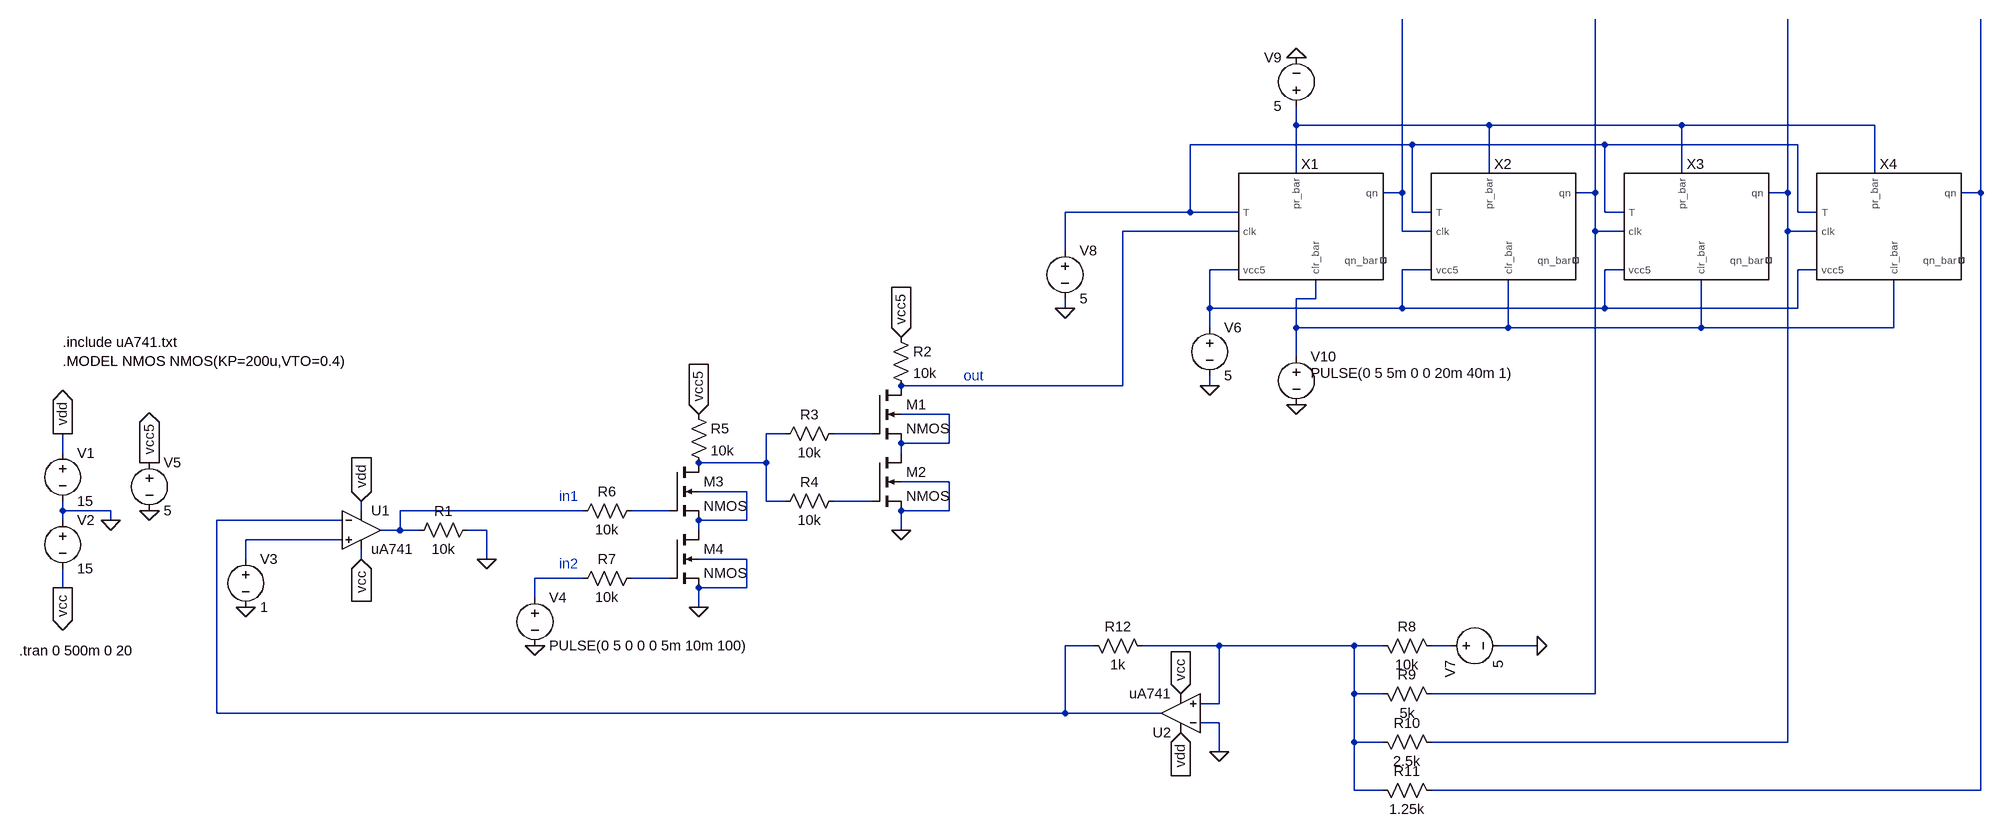
[diagram p0: schematic adc.asc]
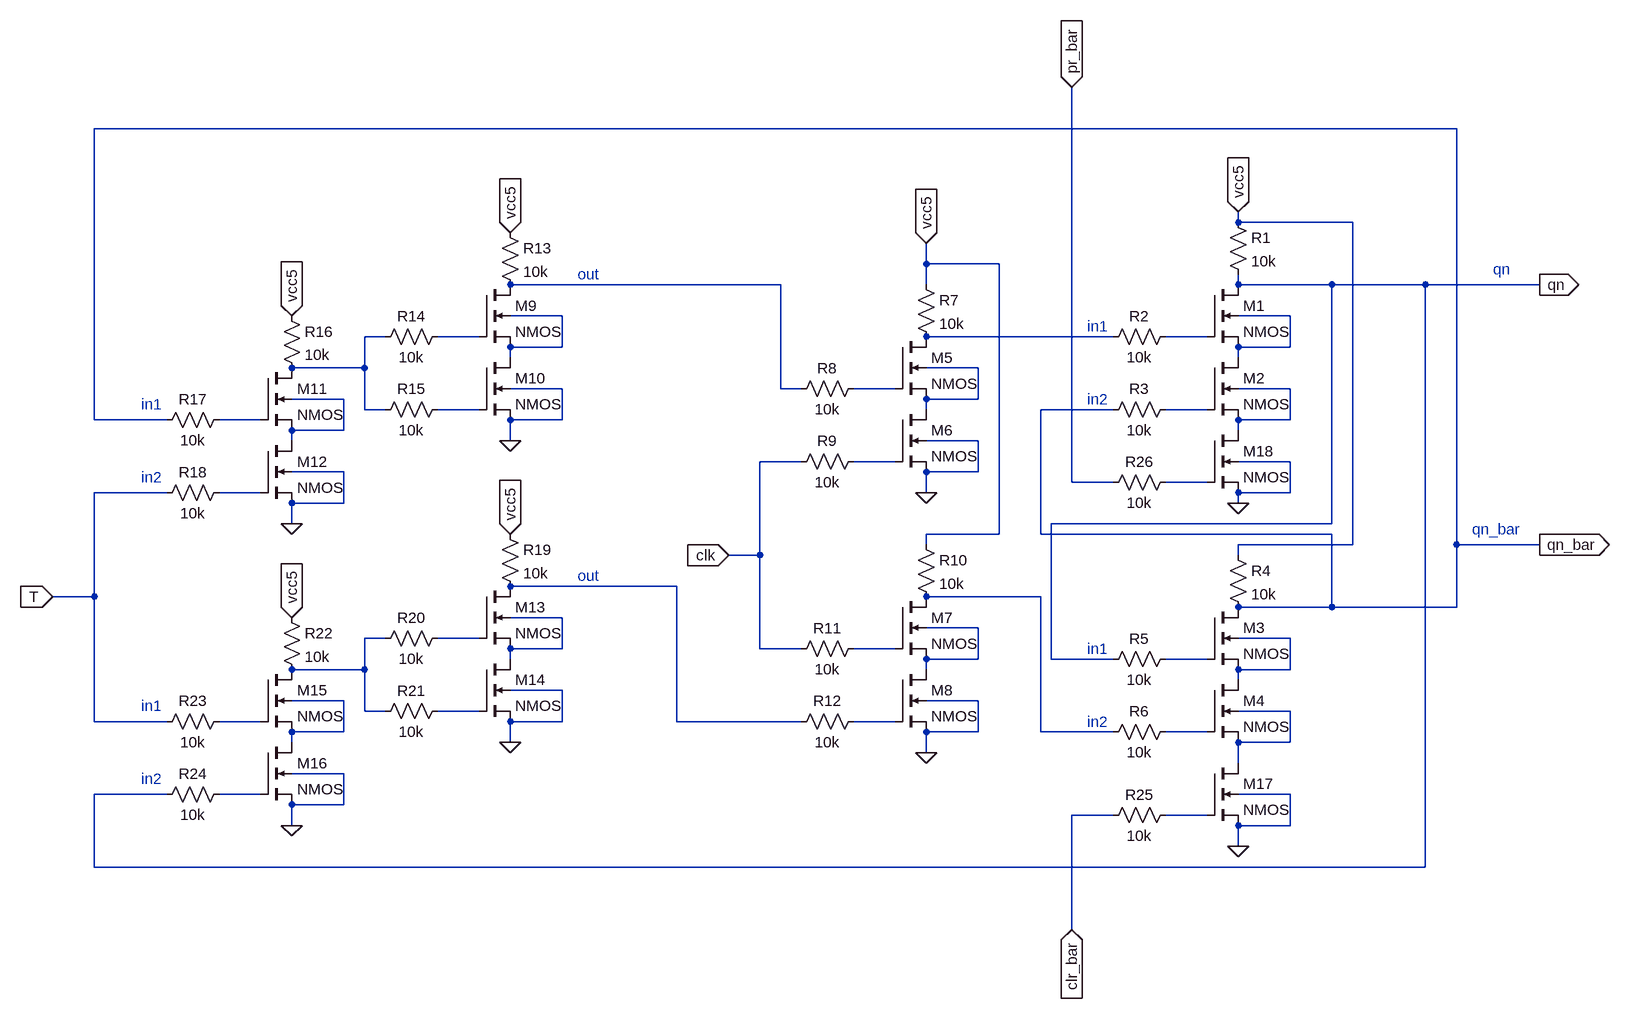
[diagram p1: sub-circuit t_ff_scimatic.asc]
adc.asc, the LTspice schematic file:
Version 4
SHEET 1 2512 680
WIRE 1360 -592 1360 -624
WIRE 1680 -592 1360 -592
WIRE 2000 -592 1680 -592
WIRE 2320 -592 2000 -592
WIRE 1552 -560 1184 -560
WIRE 1872 -560 1552 -560
WIRE 2192 -560 1872 -560
WIRE 1360 -512 1360 -592
WIRE 1680 -512 1680 -592
WIRE 2000 -512 2000 -592
WIRE 2320 -512 2320 -592
WIRE 1536 -480 1536 -768
WIRE 1536 -480 1504 -480
WIRE 1856 -480 1856 -768
WIRE 1856 -480 1824 -480
WIRE 2176 -480 2176 -768
WIRE 2176 -480 2144 -480
WIRE 2496 -480 2496 -768
WIRE 2496 -480 2464 -480
WIRE 1184 -448 1184 -560
WIRE 1184 -448 976 -448
WIRE 1264 -448 1184 -448
WIRE 1552 -448 1552 -560
WIRE 1584 -448 1552 -448
WIRE 1872 -448 1872 -560
WIRE 1904 -448 1872 -448
WIRE 2192 -448 2192 -560
WIRE 2224 -448 2192 -448
WIRE 1264 -416 1072 -416
WIRE 1536 -416 1536 -480
WIRE 1584 -416 1536 -416
WIRE 1856 -416 1856 -480
WIRE 1904 -416 1856 -416
WIRE 2176 -416 2176 -480
WIRE 2224 -416 2176 -416
WIRE 976 -384 976 -448
WIRE 1264 -352 1216 -352
WIRE 1584 -352 1536 -352
WIRE 1904 -352 1872 -352
WIRE 2224 -352 2192 -352
WIRE 1392 -304 1392 -336
WIRE 1392 -304 1360 -304
WIRE 976 -288 976 -304
WIRE 1216 -288 1216 -352
WIRE 1536 -288 1536 -352
WIRE 1536 -288 1216 -288
WIRE 1872 -288 1872 -352
WIRE 1872 -288 1536 -288
WIRE 2192 -288 2192 -352
WIRE 2192 -288 1872 -288
WIRE 1216 -256 1216 -288
WIRE 1360 -256 1360 -304
WIRE 1712 -256 1712 -336
WIRE 1712 -256 1360 -256
WIRE 2032 -256 2032 -336
WIRE 2032 -256 1712 -256
WIRE 2352 -256 2352 -336
WIRE 2352 -256 2032 -256
WIRE 1360 -208 1360 -256
WIRE 1072 -160 1072 -416
WIRE 1072 -160 704 -160
WIRE 1216 -160 1216 -176
WIRE 784 -112 704 -112
WIRE 512 -80 480 -80
WIRE 656 -80 592 -80
WIRE 784 -64 784 -112
WIRE 784 -64 704 -64
WIRE -688 -48 -688 -80
WIRE 704 -48 704 -64
WIRE 480 -32 480 -80
WIRE 480 -32 368 -32
WIRE 784 0 704 0
WIRE 448 16 368 16
WIRE 480 32 480 -32
WIRE 512 32 480 32
WIRE 656 32 592 32
WIRE -688 48 -688 32
WIRE -608 48 -688 48
WIRE -192 48 -192 32
WIRE 176 48 -128 48
WIRE 320 48 256 48
WIRE 784 48 784 0
WIRE 784 48 704 48
WIRE -688 64 -688 48
WIRE -608 64 -608 48
WIRE -224 64 -432 64
WIRE 448 64 448 16
WIRE 448 64 368 64
WIRE -128 80 -128 48
WIRE -128 80 -160 80
WIRE -96 80 -128 80
WIRE 16 80 -16 80
WIRE 368 80 368 64
WIRE 704 80 704 48
WIRE -224 96 -384 96
WIRE -384 128 -384 96
WIRE -192 128 -192 112
WIRE 16 128 16 80
WIRE 448 128 368 128
WIRE 176 160 96 160
WIRE 320 160 256 160
WIRE -688 176 -688 144
WIRE 448 176 448 128
WIRE 448 176 368 176
WIRE 96 192 96 160
WIRE 368 208 368 176
WIRE 1024 272 976 272
WIRE 1232 272 1104 272
WIRE 1456 272 1232 272
WIRE 1504 272 1456 272
WIRE 1616 272 1584 272
WIRE 1760 272 1696 272
WIRE 1456 352 1456 272
WIRE 1504 352 1456 352
WIRE 1856 352 1856 -416
WIRE 1856 352 1584 352
WIRE 1232 368 1232 272
WIRE 1232 368 1200 368
WIRE -432 384 -432 64
WIRE 976 384 976 272
WIRE 976 384 -432 384
WIRE 1136 384 976 384
WIRE 1232 400 1200 400
WIRE 1456 432 1456 352
WIRE 1504 432 1456 432
WIRE 2176 432 2176 -416
WIRE 2176 432 1584 432
WIRE 1232 448 1232 400
WIRE 1456 512 1456 432
WIRE 1504 512 1456 512
WIRE 2496 512 2496 -480
WIRE 2496 512 1584 512
FLAG -192 128 vcc
IOPIN -192 128 In
FLAG -192 32 vdd
IOPIN -192 32 In
FLAG -608 64 0
FLAG -688 -80 vdd
IOPIN -688 -80 Out
FLAG -688 176 vcc
IOPIN -688 176 Out
FLAG 16 128 0
FLAG -384 208 0
FLAG 704 80 0
FLAG 368 208 0
FLAG 96 272 0
FLAG 704 -240 vcc5
IOPIN 704 -240 In
FLAG 368 -112 vcc5
IOPIN 368 -112 In
FLAG -544 48 0
FLAG -544 -32 vcc5
IOPIN -544 -32 Out
FLAG 1216 -160 0
FLAG 976 -288 0
FLAG 1360 -128 0
FLAG 1360 -704 0
FLAG 1760 272 0
FLAG 1232 448 0
FLAG 1168 416 vdd
IOPIN 1168 416 In
FLAG 1168 352 vcc
IOPIN 1168 352 In
DATAFLAG 1536 -672 ""
DATAFLAG 1856 -672 ""
DATAFLAG 2176 -672 ""
DATAFLAG 2496 -688 ""
DATAFLAG 1024 -160 ""
DATAFLAG 656 384 ""
DATAFLAG 1360 272 ""
SYMBOL OpAmps\\opamp2 -192 16 R0
SYMATTR InstName U1
SYMATTR Value uA741
SYMBOL voltage -688 -64 R0
WINDOW 123 0 0 Left 0
WINDOW 39 0 0 Left 0
SYMATTR InstName V1
SYMATTR Value 15
SYMBOL voltage -688 48 R0
WINDOW 123 0 0 Left 0
WINDOW 39 0 0 Left 0
SYMATTR InstName V2
SYMATTR Value 15
SYMBOL res 0 64 R90
WINDOW 0 0 56 VBottom 2
WINDOW 3 32 56 VTop 2
SYMATTR InstName R1
SYMATTR Value 10k
SYMBOL voltage -384 112 R0
WINDOW 123 0 0 Left 0
WINDOW 39 0 0 Left 0
SYMATTR InstName V3
SYMATTR Value 1
SYMBOL nmos4 656 -160 R0
SYMATTR InstName M1
SYMATTR Value2 l=0.5u w=400u
SYMBOL nmos4 656 -48 R0
SYMATTR InstName M2
SYMATTR Value2 l=0.5u w=400u
SYMBOL res 688 -256 R0
SYMATTR InstName R2
SYMATTR Value 10k
SYMBOL res 608 -96 R90
WINDOW 0 0 56 VBottom 2
WINDOW 3 32 56 VTop 2
SYMATTR InstName R3
SYMATTR Value 10k
SYMBOL res 608 16 R90
WINDOW 0 0 56 VBottom 2
WINDOW 3 32 56 VTop 2
SYMATTR InstName R4
SYMATTR Value 10k
SYMBOL nmos4 320 -32 R0
SYMATTR InstName M3
SYMATTR Value2 l=0.5u w=400u
SYMBOL nmos4 320 80 R0
SYMATTR InstName M4
SYMATTR Value2 l=0.5u w=400u
SYMBOL res 352 -128 R0
SYMATTR InstName R5
SYMATTR Value 10k
SYMBOL res 272 32 R90
WINDOW 0 0 56 VBottom 2
WINDOW 3 32 56 VTop 2
SYMATTR InstName R6
SYMATTR Value 10k
SYMBOL res 272 144 R90
WINDOW 0 0 56 VBottom 2
WINDOW 3 32 56 VTop 2
SYMATTR InstName R7
SYMATTR Value 10k
SYMBOL voltage 96 176 R0
WINDOW 123 0 0 Left 0
WINDOW 39 0 0 Left 0
SYMATTR InstName V4
SYMATTR Value PULSE(0 5 0 0 0 5m 10m 100)
SYMBOL voltage -544 -48 R0
WINDOW 123 0 0 Left 0
WINDOW 39 0 0 Left 0
SYMATTR InstName V5
SYMATTR Value 5
SYMBOL T_FF_scimatic 1376 -416 R0
SYMATTR InstName X1
SYMBOL T_FF_scimatic 1696 -416 R0
SYMATTR InstName X2
SYMBOL T_FF_scimatic 2016 -416 R0
SYMATTR InstName X3
SYMBOL T_FF_scimatic 2336 -416 R0
SYMATTR InstName X4
SYMBOL voltage 1216 -272 R0
WINDOW 123 0 0 Left 0
WINDOW 39 0 0 Left 0
SYMATTR InstName V6
SYMATTR Value 5
SYMBOL voltage 976 -400 R0
WINDOW 123 0 0 Left 0
WINDOW 39 0 0 Left 0
SYMATTR InstName V8
SYMATTR Value 5
SYMBOL voltage 1360 -608 R180
WINDOW 0 24 96 Left 2
WINDOW 3 24 16 Left 2
WINDOW 123 0 0 Left 0
WINDOW 39 0 0 Left 0
SYMATTR InstName V9
SYMATTR Value 5
SYMBOL voltage 1360 -224 R0
WINDOW 3 24 44 Left 2
WINDOW 123 0 0 Left 0
WINDOW 39 0 0 Left 0
SYMATTR Value PULSE(0 5 5m 0 0 20m 40m 1)
SYMATTR InstName V10
SYMBOL res 1488 256 M90
WINDOW 0 0 56 VBottom 2
WINDOW 3 32 56 VTop 2
SYMATTR InstName R8
SYMATTR Value 10k
SYMBOL res 1488 336 M90
WINDOW 0 0 56 VBottom 2
WINDOW 3 32 56 VTop 2
SYMATTR InstName R9
SYMATTR Value 5k
SYMBOL res 1488 416 M90
WINDOW 0 0 56 VBottom 2
WINDOW 3 32 56 VTop 2
SYMATTR InstName R10
SYMATTR Value 2.5k
SYMBOL res 1488 496 M90
WINDOW 0 0 56 VBottom 2
WINDOW 3 32 56 VTop 2
SYMATTR InstName R11
SYMATTR Value 1.25k
SYMBOL OpAmps\\opamp2 1168 448 R180
SYMATTR InstName U2
SYMATTR Value uA741
SYMBOL res 1008 256 M90
WINDOW 0 0 56 VBottom 2
WINDOW 3 32 56 VTop 2
SYMATTR InstName R12
SYMATTR Value 1k
SYMBOL voltage 1600 272 M90
WINDOW 123 0 0 Left 0
WINDOW 39 0 0 Left 0
SYMATTR InstName V7
SYMATTR Value 5
TEXT -760 280 Left 2 !.tran 0 500m 0 20
TEXT -688 -232 Left 2 !.include uA741.txt
TEXT 808 -176 Left 2 ;out
TEXT 136 24 Left 2 ;in1
TEXT 136 136 Left 2 ;in2
TEXT -688 -200 Left 2 !.MODEL NMOS NMOS(KP=200u,VTO=0.4)

t_ff_scimatic.asc, the sub-circuit schematic file:
Version 4
SHEET 1 1280 960
WIRE 1008 -416 -1088 -416
WIRE 672 -272 672 -288
WIRE 848 -272 672 -272
WIRE 192 -208 192 -240
WIRE 304 -208 192 -208
WIRE -32 -176 -448 -176
WIRE 192 -176 192 -208
WIRE 672 -176 672 -192
WIRE 816 -176 672 -176
WIRE 960 -176 816 -176
WIRE 1136 -176 960 -176
WIRE -368 -128 -448 -128
WIRE 752 -128 672 -128
WIRE -640 -96 -672 -96
WIRE -496 -96 -560 -96
WIRE 480 -96 192 -96
WIRE 624 -96 560 -96
WIRE -368 -80 -368 -128
WIRE -368 -80 -448 -80
WIRE 752 -80 752 -128
WIRE 752 -80 672 -80
WIRE -448 -64 -448 -80
WIRE 672 -64 672 -80
WIRE -672 -48 -672 -96
WIRE -672 -48 -784 -48
WIRE 272 -48 192 -48
WIRE -368 -16 -448 -16
WIRE -32 -16 -32 -176
WIRE 0 -16 -32 -16
WIRE 144 -16 80 -16
WIRE 752 -16 672 -16
WIRE -704 0 -784 0
WIRE 272 0 272 -48
WIRE 272 0 192 0
WIRE -672 16 -672 -48
WIRE -640 16 -672 16
WIRE -496 16 -560 16
WIRE 192 16 192 0
WIRE 480 16 368 16
WIRE 624 16 560 16
WIRE -1088 32 -1088 -416
WIRE -976 32 -1088 32
WIRE -832 32 -896 32
WIRE -368 32 -368 -16
WIRE -368 32 -448 32
WIRE 752 32 752 -16
WIRE 752 32 672 32
WIRE -704 48 -704 0
WIRE -704 48 -784 48
WIRE 672 48 672 32
WIRE -784 64 -784 48
WIRE -448 64 -448 32
WIRE 272 64 192 64
WIRE 0 96 -64 96
WIRE 144 96 80 96
WIRE 752 96 672 96
WIRE -704 112 -784 112
WIRE 272 112 272 64
WIRE 272 112 192 112
WIRE 416 128 416 -480
WIRE 480 128 416 128
WIRE 624 128 560 128
WIRE -976 144 -1088 144
WIRE -832 144 -896 144
WIRE 192 144 192 112
WIRE 752 144 752 96
WIRE 752 144 672 144
WIRE -704 160 -704 112
WIRE -704 160 -784 160
WIRE 672 160 672 144
WIRE -784 192 -784 160
WIRE 816 192 816 -176
WIRE 816 192 384 192
WIRE 304 208 304 -208
WIRE 304 208 192 208
WIRE 368 208 368 16
WIRE 816 208 368 208
WIRE 192 224 192 208
WIRE 848 224 848 -272
WIRE 848 224 672 224
WIRE 1008 224 1008 -416
WIRE 1136 224 1008 224
WIRE -64 240 -64 96
WIRE -64 240 -112 240
WIRE 672 240 672 224
WIRE -192 288 -448 288
WIRE -1088 304 -1088 144
WIRE -1088 304 -1152 304
WIRE 368 304 192 304
WIRE 816 320 816 208
WIRE 816 320 672 320
WIRE 1008 320 1008 224
WIRE 1008 320 816 320
WIRE -368 336 -448 336
WIRE 272 352 192 352
WIRE -640 368 -672 368
WIRE -496 368 -560 368
WIRE 752 368 672 368
WIRE -368 384 -368 336
WIRE -368 384 -448 384
WIRE -64 384 -64 240
WIRE 0 384 -64 384
WIRE 144 384 80 384
WIRE -448 400 -448 384
WIRE 272 400 272 352
WIRE 272 400 192 400
WIRE 384 400 384 192
WIRE 480 400 384 400
WIRE 624 400 560 400
WIRE -672 416 -672 368
WIRE -672 416 -784 416
WIRE 192 416 192 400
WIRE 752 416 752 368
WIRE 752 416 672 416
WIRE 672 432 672 416
WIRE -368 448 -448 448
WIRE -704 464 -784 464
WIRE 272 464 192 464
WIRE -672 480 -672 416
WIRE -640 480 -672 480
WIRE -496 480 -560 480
WIRE 752 480 672 480
WIRE -1088 496 -1088 304
WIRE -976 496 -1088 496
WIRE -832 496 -896 496
WIRE -368 496 -368 448
WIRE -368 496 -448 496
WIRE -192 496 -192 288
WIRE 0 496 -192 496
WIRE 144 496 80 496
WIRE -704 512 -704 464
WIRE -704 512 -784 512
WIRE 272 512 272 464
WIRE 272 512 192 512
WIRE 368 512 368 304
WIRE 480 512 368 512
WIRE 624 512 560 512
WIRE -784 528 -784 512
WIRE -448 528 -448 496
WIRE 752 528 752 480
WIRE 752 528 672 528
WIRE 192 544 192 512
WIRE 672 560 672 528
WIRE -704 576 -784 576
WIRE -976 608 -1088 608
WIRE -832 608 -896 608
WIRE 752 608 672 608
WIRE -704 624 -704 576
WIRE -704 624 -784 624
WIRE 480 640 416 640
WIRE 624 640 560 640
WIRE -784 656 -784 624
WIRE 752 656 752 608
WIRE 752 656 672 656
WIRE 672 688 672 656
WIRE -1088 720 -1088 608
WIRE 960 720 960 -176
WIRE 960 720 -1088 720
WIRE 416 816 416 640
FLAG 672 -288 vcc5
IOPIN 672 -288 In
FLAG 192 144 0
FLAG 192 544 0
FLAG 192 -240 vcc5
IOPIN 192 -240 In
FLAG -448 64 0
FLAG -784 192 0
FLAG -448 -256 vcc5
IOPIN -448 -256 In
FLAG -784 -128 vcc5
IOPIN -784 -128 In
FLAG -448 528 0
FLAG -784 656 0
FLAG -448 208 vcc5
IOPIN -448 208 In
FLAG -784 336 vcc5
IOPIN -784 336 In
FLAG 1136 -176 qn
IOPIN 1136 -176 Out
FLAG 1136 224 qn_bar
IOPIN 1136 224 Out
FLAG -1152 304 T
IOPIN -1152 304 In
FLAG -112 240 clk
IOPIN -112 240 In
FLAG 672 688 0
FLAG 672 160 0
FLAG 416 -480 pr_bar
IOPIN 416 -480 In
FLAG 416 816 clr_bar
IOPIN 416 816 In
SYMBOL nmos4 624 -176 R0
SYMATTR InstName M1
SYMATTR Value2 l=0.5u w=400u
SYMBOL nmos4 624 -64 R0
SYMATTR InstName M2
SYMATTR Value2 l=0.5u w=400u
SYMBOL res 656 -288 R0
SYMATTR InstName R1
SYMATTR Value 10k
SYMBOL res 576 -112 R90
WINDOW 0 0 56 VBottom 2
WINDOW 3 32 56 VTop 2
SYMATTR InstName R2
SYMATTR Value 10k
SYMBOL res 576 0 R90
WINDOW 0 0 56 VBottom 2
WINDOW 3 32 56 VTop 2
SYMATTR InstName R3
SYMATTR Value 10k
SYMBOL nmos4 624 320 R0
SYMATTR InstName M3
SYMATTR Value2 l=0.5u w=400u
SYMBOL nmos4 624 432 R0
SYMATTR InstName M4
SYMATTR Value2 l=0.5u w=400u
SYMBOL res 656 224 R0
SYMATTR InstName R4
SYMATTR Value 10k
SYMBOL res 576 384 R90
WINDOW 0 0 56 VBottom 2
WINDOW 3 32 56 VTop 2
SYMATTR InstName R5
SYMATTR Value 10k
SYMBOL res 576 496 R90
WINDOW 0 0 56 VBottom 2
WINDOW 3 32 56 VTop 2
SYMATTR InstName R6
SYMATTR Value 10k
SYMBOL nmos4 144 -96 R0
SYMATTR InstName M5
SYMATTR Value2 l=0.5u w=400u
SYMBOL nmos4 144 16 R0
SYMATTR InstName M6
SYMATTR Value2 l=0.5u w=400u
SYMBOL res 176 -192 R0
SYMATTR InstName R7
SYMATTR Value 10k
SYMBOL res 96 -32 R90
WINDOW 0 0 56 VBottom 2
WINDOW 3 32 56 VTop 2
SYMATTR InstName R8
SYMATTR Value 10k
SYMBOL res 96 80 R90
WINDOW 0 0 56 VBottom 2
WINDOW 3 32 56 VTop 2
SYMATTR InstName R9
SYMATTR Value 10k
SYMBOL nmos4 144 304 R0
SYMATTR InstName M7
SYMATTR Value2 l=0.5u w=400u
SYMBOL nmos4 144 416 R0
SYMATTR InstName M8
SYMATTR Value2 l=0.5u w=400u
SYMBOL res 176 208 R0
SYMATTR InstName R10
SYMATTR Value 10k
SYMBOL res 96 368 R90
WINDOW 0 0 56 VBottom 2
WINDOW 3 32 56 VTop 2
SYMATTR InstName R11
SYMATTR Value 10k
SYMBOL res 96 480 R90
WINDOW 0 0 56 VBottom 2
WINDOW 3 32 56 VTop 2
SYMATTR InstName R12
SYMATTR Value 10k
SYMBOL nmos4 -496 -176 R0
SYMATTR InstName M9
SYMATTR Value2 l=0.5u w=400u
SYMBOL nmos4 -496 -64 R0
SYMATTR InstName M10
SYMATTR Value2 l=0.5u w=400u
SYMBOL res -464 -272 R0
SYMATTR InstName R13
SYMATTR Value 10k
SYMBOL res -544 -112 R90
WINDOW 0 0 56 VBottom 2
WINDOW 3 32 56 VTop 2
SYMATTR InstName R14
SYMATTR Value 10k
SYMBOL res -544 0 R90
WINDOW 0 0 56 VBottom 2
WINDOW 3 32 56 VTop 2
SYMATTR InstName R15
SYMATTR Value 10k
SYMBOL nmos4 -832 -48 R0
SYMATTR InstName M11
SYMATTR Value2 l=0.5u w=400u
SYMBOL nmos4 -832 64 R0
SYMATTR InstName M12
SYMATTR Value2 l=0.5u w=400u
SYMBOL res -800 -144 R0
SYMATTR InstName R16
SYMATTR Value 10k
SYMBOL res -880 16 R90
WINDOW 0 0 56 VBottom 2
WINDOW 3 32 56 VTop 2
SYMATTR InstName R17
SYMATTR Value 10k
SYMBOL res -880 128 R90
WINDOW 0 0 56 VBottom 2
WINDOW 3 32 56 VTop 2
SYMATTR InstName R18
SYMATTR Value 10k
SYMBOL nmos4 -496 288 R0
SYMATTR InstName M13
SYMATTR Value2 l=0.5u w=400u
SYMBOL nmos4 -496 400 R0
SYMATTR InstName M14
SYMATTR Value2 l=0.5u w=400u
SYMBOL res -464 192 R0
SYMATTR InstName R19
SYMATTR Value 10k
SYMBOL res -544 352 R90
WINDOW 0 0 56 VBottom 2
WINDOW 3 32 56 VTop 2
SYMATTR InstName R20
SYMATTR Value 10k
SYMBOL res -544 464 R90
WINDOW 0 0 56 VBottom 2
WINDOW 3 32 56 VTop 2
SYMATTR InstName R21
SYMATTR Value 10k
SYMBOL nmos4 -832 416 R0
SYMATTR InstName M15
SYMATTR Value2 l=0.5u w=400u
SYMBOL nmos4 -832 528 R0
SYMATTR InstName M16
SYMATTR Value2 l=0.5u w=400u
SYMBOL res -800 320 R0
SYMATTR InstName R22
SYMATTR Value 10k
SYMBOL res -880 480 R90
WINDOW 0 0 56 VBottom 2
WINDOW 3 32 56 VTop 2
SYMATTR InstName R23
SYMATTR Value 10k
SYMBOL res -880 592 R90
WINDOW 0 0 56 VBottom 2
WINDOW 3 32 56 VTop 2
SYMATTR InstName R24
SYMATTR Value 10k
SYMBOL nmos4 624 560 R0
SYMATTR InstName M17
SYMATTR Value2 l=0.5u w=400u
SYMBOL res 576 624 R90
WINDOW 0 0 56 VBottom 2
WINDOW 3 32 56 VTop 2
SYMATTR InstName R25
SYMATTR Value 10k
SYMBOL nmos4 624 48 R0
SYMATTR InstName M18
SYMATTR Value2 l=0.5u w=400u
SYMBOL res 576 112 R90
WINDOW 0 0 56 VBottom 2
WINDOW 3 32 56 VTop 2
SYMATTR InstName R26
SYMATTR Value 10k
TEXT 1064 -200 Left 2 ;qn
TEXT 440 -112 Left 2 ;in1
TEXT 440 0 Left 2 ;in2
TEXT 1032 200 Left 2 ;qn_bar
TEXT 440 384 Left 2 ;in1
TEXT 440 496 Left 2 ;in2
TEXT -344 -192 Left 2 ;out
TEXT -1016 8 Left 2 ;in1
TEXT -1016 120 Left 2 ;in2
TEXT -344 272 Left 2 ;out
TEXT -1016 472 Left 2 ;in1
TEXT -1016 584 Left 2 ;in2

The netlist it stands for:
* adc.asc
XU1 N018 N017 vdd vcc N015 uA741  ; pins In+ In- V+ V- OUT
V1 vdd 0 15
V2 0 vcc 15
R1 0 N015 10k
V3 N018 0 1
M1 N007 N012 N010 N010 NMOS l=0.5u w=400u
M2 N010 N014 0 0 NMOS l=0.5u w=400u
R2 vcc5 N007 10k
R3 N012 N011 10k
R4 N014 N011 10k
M3 N011 N016 N013 N013 NMOS l=0.5u w=400u
M4 N013 N020 0 0 NMOS l=0.5u w=400u
R5 vcc5 N011 10k
R6 N016 N015 10k
R7 N020 N019 10k
V4 N019 0 PULSE(0 5 0 0 0 5m 10m 100)
V5 vcc5 0 5
XX1 N007 N009 N001 N002 N008 N003 NC_01 t_ff_scimatic
XX2 N003 N009 N001 N002 N008 N004 NC_02 t_ff_scimatic
XX3 N004 N009 N001 N002 N008 N005 NC_03 t_ff_scimatic
XX4 N005 N009 N001 N002 N008 N006 NC_04 t_ff_scimatic
V6 N008 0 5
V8 N002 0 5
V9 N001 0 5
V10 N009 0 PULSE(0 5 5m 0 0 20m 40m 1)
R8 N021 N022 10k
R9 N021 N004 5k
R10 N021 N005 2.5k
R11 N021 N006 1.25k
XU2 N021 0 vdd vcc N017 uA741  ; pins In+ In- V+ V- OUT
R12 N017 N021 1k
V7 N022 0 5

* block symbol definitions
.subckt t_ff_scimatic clk clr_bar pr_bar T vcc5 qn qn_bar
M1 qn N007 N003 N003 NMOS l=0.5u w=400u
M2 N003 N013 N010 N010 NMOS l=0.5u w=400u
R1 vcc5 qn 10k
R2 N007 N006 10k
R3 N013 qn_bar 10k
M3 qn_bar N026 N024 N024 NMOS l=0.5u w=400u
M4 N024 N032 N029 N029 NMOS l=0.5u w=400u
R4 vcc5 qn_bar 10k
R5 N026 qn 10k
R6 N032 N019 10k
M5 N006 N009 N008 N008 NMOS l=0.5u w=400u
M6 N008 N015 0 0 NMOS l=0.5u w=400u
R7 vcc5 N006 10k
R8 N009 N001 10k
R9 N015 clk 10k
M7 N019 N025 N021 N021 NMOS l=0.5u w=400u
M8 N021 N031 0 0 NMOS l=0.5u w=400u
R10 vcc5 N019 10k
R11 N025 clk 10k
R12 N031 N018 10k
M9 N001 N005 N002 N002 NMOS l=0.5u w=400u
M10 N002 N012 0 0 NMOS l=0.5u w=400u
R13 vcc5 N001 10k
R14 N005 N004 10k
R15 N012 N004 10k
M11 N004 N014 N011 N011 NMOS l=0.5u w=400u
M12 N011 N017 0 0 NMOS l=0.5u w=400u
R16 vcc5 N004 10k
R17 N014 qn_bar 10k
R18 N017 T 10k
M13 N018 N023 N020 N020 NMOS l=0.5u w=400u
M14 N020 N028 0 0 NMOS l=0.5u w=400u
R19 vcc5 N018 10k
R20 N023 N022 10k
R21 N028 N022 10k
M15 N022 N030 N027 N027 NMOS l=0.5u w=400u
M16 N027 N033 0 0 NMOS l=0.5u w=400u
R22 vcc5 N022 10k
R23 N030 T 10k
R24 N033 qn 10k
M17 N029 N034 0 0 NMOS l=0.5u w=400u
R25 N034 clr_bar 10k
M18 N010 N016 0 0 NMOS l=0.5u w=400u
R26 N016 pr_bar 10k
* qn
* in1
* in2
* qn_bar
* in1
* in2
* out
* in1
* in2
* out
* in1
* in2
.ends t_ff_scimatic

.model NMOS NMOS
.model PMOS PMOS
.lib standard.mos
.tran 0 500m 0 20
.include uA741.txt
* out
* in1
* in2
.MODEL NMOS NMOS(KP=200u,VTO=0.4)
.backanno
.end